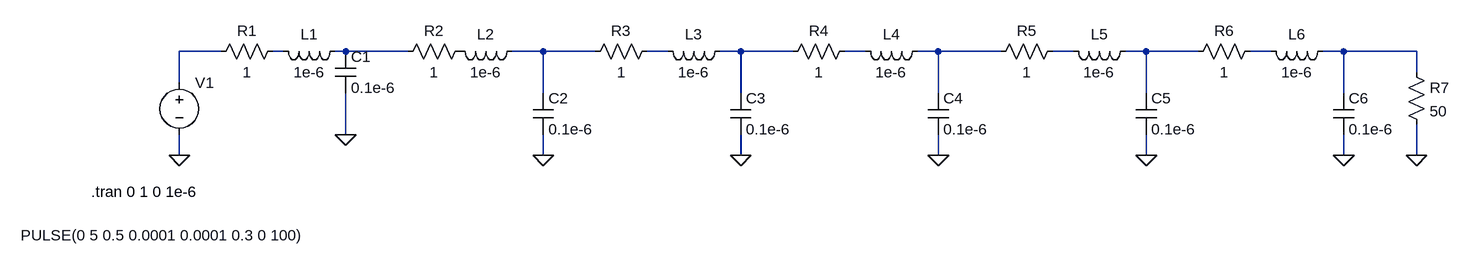
[diagram p0: schematic transmission_line.asc]
transmission_line.asc, the LTspice schematic file:
Version 4
SHEET 1 1848 680
WIRE -48 32 -112 32
WIRE 48 32 32 32
WIRE 144 32 128 32
WIRE 240 32 144 32
WIRE 448 32 400 32
WIRE 528 32 448 32
WIRE 640 32 608 32
WIRE 752 32 720 32
WIRE 832 32 752 32
WIRE 944 32 912 32
WIRE 1056 32 1024 32
WIRE 1152 32 1056 32
WIRE 1264 32 1232 32
WIRE 1376 32 1344 32
WIRE 1456 32 1376 32
WIRE 1568 32 1536 32
WIRE 1680 32 1648 32
WIRE 1792 32 1680 32
WIRE 1792 64 1792 32
WIRE -112 80 -112 32
WIRE 448 96 448 32
WIRE 752 96 752 32
WIRE 1056 96 1056 32
WIRE 1376 96 1376 32
WIRE 1680 96 1680 32
WIRE 144 160 144 96
WIRE -112 192 -112 160
WIRE 448 192 448 160
WIRE 752 192 752 160
WIRE 1056 192 1056 160
WIRE 1376 192 1376 160
WIRE 1680 192 1680 160
WIRE 1792 192 1792 144
FLAG 144 160 0
FLAG -112 192 0
FLAG 448 192 0
FLAG 752 192 0
FLAG 1056 192 0
FLAG 1376 192 0
FLAG 1680 192 0
FLAG 1792 192 0
SYMBOL cap 128 32 R0
SYMATTR InstName C1
SYMATTR Value 0.1e-6
SYMBOL ind 144 16 R90
WINDOW 0 5 56 VBottom 2
WINDOW 3 32 56 VTop 2
SYMATTR InstName L1
SYMATTR Value 1e-6
SYMBOL res 48 16 R90
WINDOW 0 0 56 VBottom 2
WINDOW 3 32 56 VTop 2
SYMATTR InstName R1
SYMATTR Value 1
SYMBOL voltage -112 64 R0
WINDOW 3 -244 251 Left 2
WINDOW 123 0 0 Left 0
WINDOW 39 0 0 Left 0
SYMATTR Value PULSE(0 5 0.5 0.0001 0.0001 0.3 0 100)
SYMATTR InstName V1
SYMBOL cap 432 96 R0
SYMATTR InstName C2
SYMATTR Value 0.1e-6
SYMBOL ind 416 16 R90
WINDOW 0 5 56 VBottom 2
WINDOW 3 32 56 VTop 2
SYMATTR InstName L2
SYMATTR Value 1e-6
SYMBOL res 336 16 R90
WINDOW 0 0 56 VBottom 2
WINDOW 3 32 56 VTop 2
SYMATTR InstName R2
SYMATTR Value 1
SYMBOL cap 736 96 R0
SYMATTR InstName C3
SYMATTR Value 0.1e-6
SYMBOL ind 736 16 R90
WINDOW 0 5 56 VBottom 2
WINDOW 3 32 56 VTop 2
SYMATTR InstName L3
SYMATTR Value 1e-6
SYMBOL res 624 16 R90
WINDOW 0 0 56 VBottom 2
WINDOW 3 32 56 VTop 2
SYMATTR InstName R3
SYMATTR Value 1
SYMBOL cap 1040 96 R0
SYMATTR InstName C4
SYMATTR Value 0.1e-6
SYMBOL ind 1040 16 R90
WINDOW 0 5 56 VBottom 2
WINDOW 3 32 56 VTop 2
SYMATTR InstName L4
SYMATTR Value 1e-6
SYMBOL res 928 16 R90
WINDOW 0 0 56 VBottom 2
WINDOW 3 32 56 VTop 2
SYMATTR InstName R4
SYMATTR Value 1
SYMBOL cap 1360 96 R0
SYMATTR InstName C5
SYMATTR Value 0.1e-6
SYMBOL ind 1360 16 R90
WINDOW 0 5 56 VBottom 2
WINDOW 3 32 56 VTop 2
SYMATTR InstName L5
SYMATTR Value 1e-6
SYMBOL res 1248 16 R90
WINDOW 0 0 56 VBottom 2
WINDOW 3 32 56 VTop 2
SYMATTR InstName R5
SYMATTR Value 1
SYMBOL cap 1664 96 R0
SYMATTR InstName C6
SYMATTR Value 0.1e-6
SYMBOL ind 1664 16 R90
WINDOW 0 5 56 VBottom 2
WINDOW 3 32 56 VTop 2
SYMATTR InstName L6
SYMATTR Value 1e-6
SYMBOL res 1552 16 R90
WINDOW 0 0 56 VBottom 2
WINDOW 3 32 56 VTop 2
SYMATTR InstName R6
SYMATTR Value 1
SYMBOL res 1776 48 R0
SYMATTR InstName R7
SYMATTR Value 50
TEXT -248 248 Left 2 !.tran 0 1 0 1e-6

The netlist it stands for:
* transmission_line.asc
C1 N003 0 0.1e-6
L1 N003 N002 1e-6
R1 N002 N001 1
V1 N001 0 PULSE(0 5 0.5 0.0001 0.0001 0.3 0 100)
C2 N004 0 0.1e-6
L2 N004 P001 1e-6
R2 P001 N003 1
C3 N006 0 0.1e-6
L3 N006 N005 1e-6
R3 N005 N004 1
C4 N008 0 0.1e-6
L4 N008 N007 1e-6
R4 N007 N006 1
C5 N010 0 0.1e-6
L5 N010 N009 1e-6
R5 N009 N008 1
C6 N012 0 0.1e-6
L6 N012 N011 1e-6
R6 N011 N010 1
R7 N012 0 50
.tran 0 1 0 1e-6
.backanno
.end